# Altium schematic sheet IMU (BMI270).SchDoc
size A; SheetNumber: 5; SheetTotal: 9
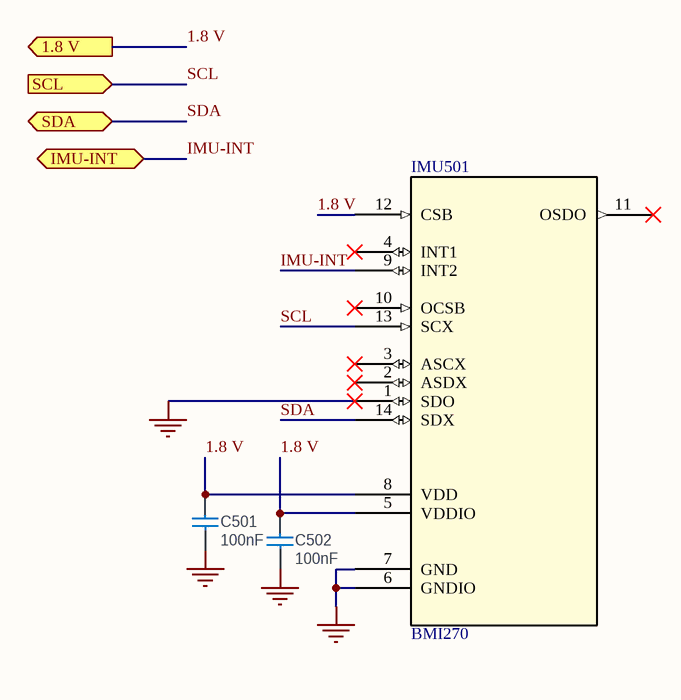
[diagram p0: IMU (BMI270).SchDoc]

## Parts
C501  100nF  [CAPC0603X03L_C]
C502  100nF  [CAPC0603X03L_C]
IMU501  BMI270  [BMI270_BOS]

## Ports
1.8 V (out, see Digital_Watch[2C], Level Shifter (PCA9306JKZ)[2B], PMIC (nPM1300)[3B], PPG (MAX30102)[1A]), IMU-INT (bidir, see Digital_Watch[2C]), SCL (in, see Digital_Watch[2C], Level Shifter (PCA9306JKZ)[2B], MCU (nrf5340)[4C], PMIC (nPM1300)[2C], PPG (MAX30102)[1A]), SDA (bidir, see Digital_Watch[2C], Level Shifter (PCA9306JKZ)[2B], MCU (nrf5340)[4C], PMIC (nPM1300)[2C], PPG (MAX30102)[1A])

## Nets
GND: C501.1 C502.1 IMU501.1(SDO) IMU501.6(GNDIO) IMU501.7(GND)
1.8 V: C501.2 C502.2 IMU501.5(VDDIO) IMU501.8(VDD) IMU501.12(CSB) ; port 1.8 V
IMU-INT: IMU501.9(INT2) ; port IMU-INT
SCL: IMU501.13(SCX) ; port SCL
SDA: IMU501.14(SDX) ; port SDA

Not connected (* = marked no-connect by the designer): IMU501 2(ASDX)* 3(ASCX)* 4(INT1)* 10(OCSB)* 11(OSDO)*

## Library data of the parts
C501 C502 = C0201-100n-16V-X7S: Capacitor, X7S, ±10%; Pad Count: 2; Value: 100nF; Footprint Doc: 0201; Component Class: Capacitors; Author: rsk
IMU501 = BMI270: Inertial Measurement Unit Digital Output 1.8V/2.5V/3.3V Automotive 14-Pin LGA; Manufacturer: Bosch Tools; Supplier: DigiKey; Supplier Part Number: 828-1091-1-ND; Manufacturer Part Number: BMI270; RoHS: Compliant; Category: Sensors; Stock: 35722; Pricing: 1=4.23, 5=3.788, 10=3.624, 25=3.428, 50=3.2942, 100=3.1715, 500=2.92464, 1000=2.8327 (USD); Export Control Classification Number (ECCN) Code: EAR99; Introduction Date: 2019-05-31; Lifecycle Status: Production; REACH SVHC: Yes; ComponentLink1URL: https://datasheet.octopart.com:443/BMI270-Bosch-Tools-datasheet-181206537.pdf?src-supplier=IHS; ComponentLink1Description: https://datasheet.octopart.com:443/BMI270-Bosch-Tools-datasheet-181206537.pdf?src-supplier=IHS; ComponentLink2URL: https://datasheet.octopart.com:443/BMI270-Bosch-Tools-datasheet-136061757.pdf?src-supplier=Future+Electronics; ComponentLink2Description: https://datasheet.octopart.com:443/BMI270-Bosch-Tools-datasheet-136061757.pdf?src-supplier=Future+Electronics; Supplier 1: DigiKey; Supplier Part Number 1: 828-1091-1-ND